# EAGLE schematic control_panel (EAGLE 6.5.0)
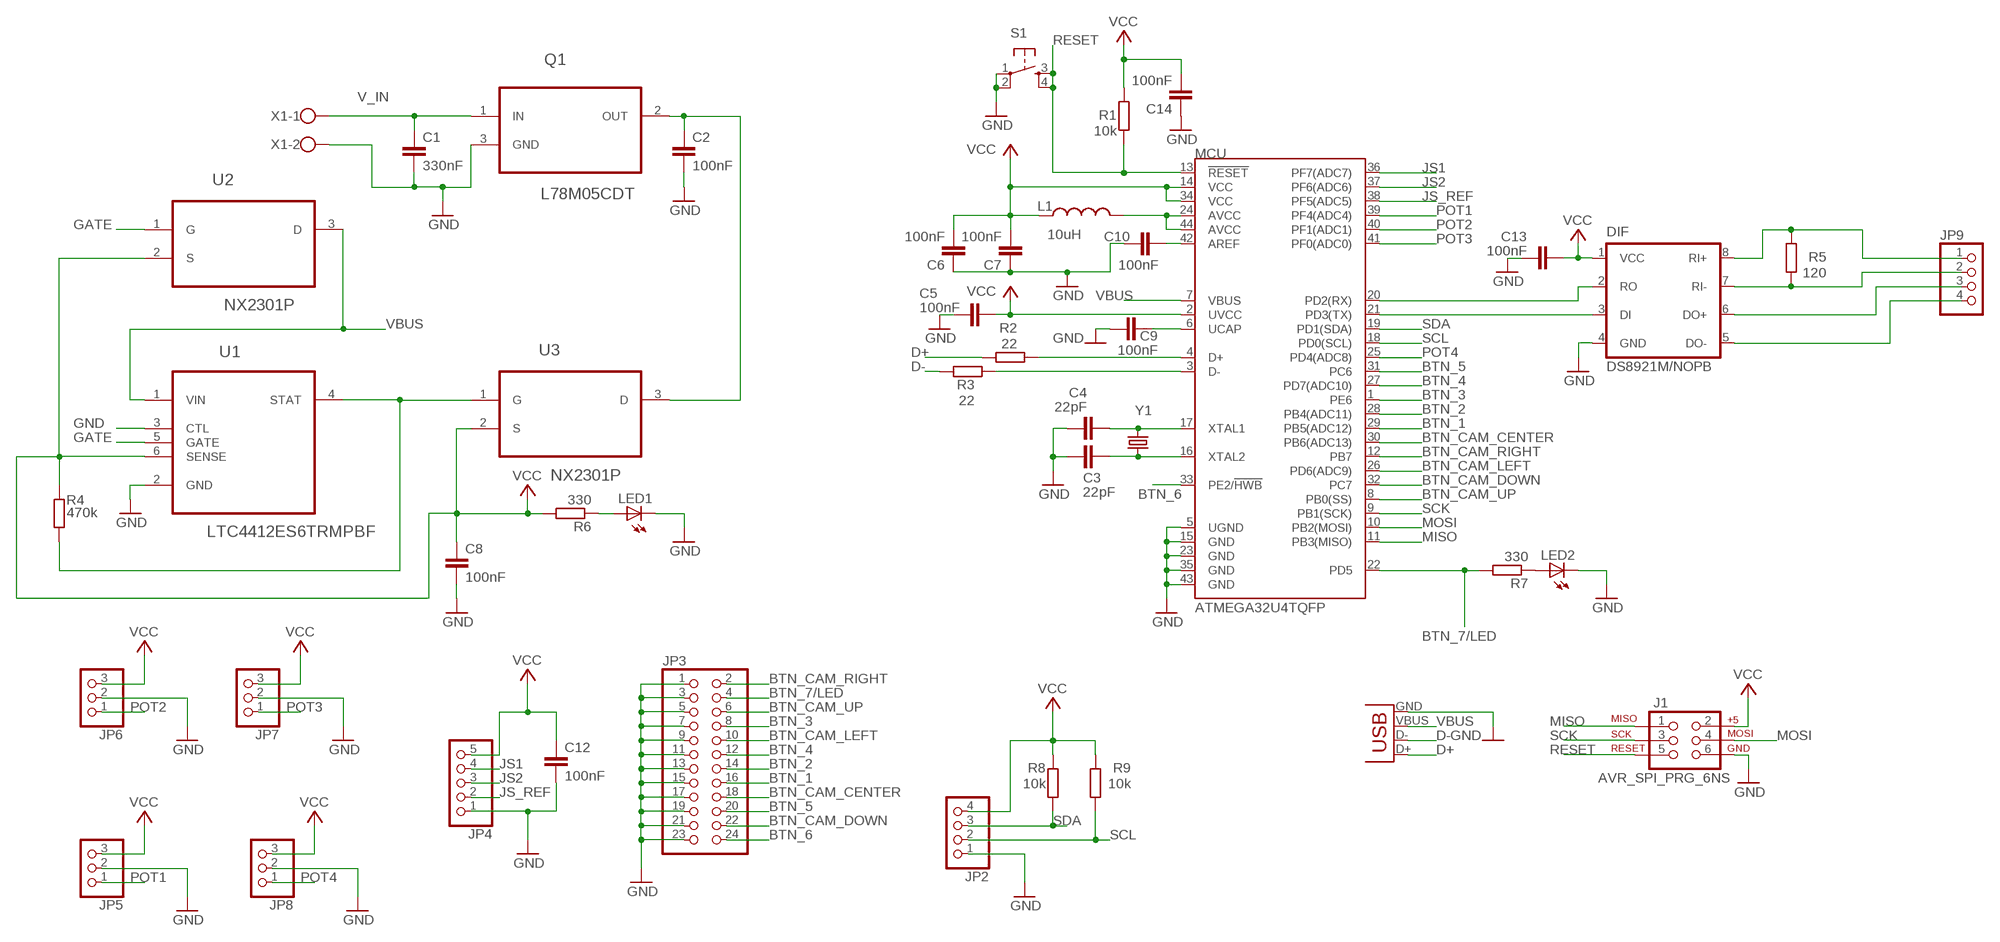
[diagram p0: schematic, sheet 1]

## Parts
C1  330nF  C-EUC0805  [C0805]
C2  100nF  C-EUC0805  [C0805]
C3  22pF  C-EUC0805  [C0805]
C4  22pF  C-EUC0805  [C0805]
C5  100nF  C-EUC0805  [C0805]
C6  100nF  C-EUC0805  [C0805]
C7  100nF  C-EUC0805  [C0805]
C8  100nF  C-EUC0805  [C0805]
C9  100nF  C-EUC0805  [C0805]
C10  100nF  C-EUC0805  [C0805]
C12  100nF  C-EUC0805  [C0805]
C13  100nF  C-EUC0805  [C0805]
C14  100nF  C-EUC0805  [C0805]
DIF  DS8921M/NOPB  [SOIC8]
J1  AVR_SPI_PRG_6NS  [2X3-NS]
JP1  USB-B  USBPTH  [USB-B-PTH]
JP2  PINHD-1X4  [1X04]
JP3  PINHD-2X12  [2X12]
JP4  PINHD-1X5  [1X05]
JP5  PINHD-1X3  [1X03]
JP6  PINHD-1X3  [1X03]
JP7  PINHD-1X3  [1X03]
JP8  PINHD-1X3  [1X03]
JP9  PINHD-1X4  [1X04]
L1  10uH  INDUCTOR0805  [0805]
LED1  LED-FKIT-1206  [FKIT-LED-1206]
LED2  LED-FKIT-1206  [FKIT-LED-1206]
MCU  ATMEGA32U4TQFP  [SPARKFUN-DIGITALIC_TQFP44]
Q1  L78M05CDT  [TO225P972X240-3N]
R1  10k  R-EU_R0805  [R0805]
R2  22  R-EU_R0805  [R0805]
R3  22  R-EU_R0805  [R0805]
R4  470k  R-EU_R0805  [R0805]
R5  120  R-EU_R0805  [R0805]
R6  330  R-EU_R0805  [R0805]
R7  330  R-EU_R0805  [R0805]
R8  10k  R-EU_R0805  [R0805]
R9  10k  R-EU_R0805  [R0805]
S1  TAC_SWITCHSMD  [TACTILE_SWITCH_SMD]
U1  LTC4412ES6TRMPBF  [SOT95P280X100-6N]
U2  NX2301P  [SOT95P230X110-3N]
U3  NX2301P  [SOT95P230X110-3N]
X1  W237-102  [W237-102]
Y1  CRYSTALSMD  [HC49UP]

## Nets
BTN_1: JP3.16 MCU.29(PB5(ADC12))
BTN_2: JP3.14 MCU.28(PB4(ADC11))
BTN_3: JP3.8 MCU.1(PE6)
BTN_4: JP3.12 MCU.27(PD7(ADC10))
BTN_5: JP3.20 MCU.31(PC6)
BTN_6: JP3.24 MCU.33(PE2/!HWB)
BTN_7/LED: JP3.4 MCU.22(PD5) R7.2
BTN_CAM_CENTER: JP3.18 MCU.30(PB6(ADC13))
BTN_CAM_DOWN: JP3.22 MCU.32(PC7)
BTN_CAM_LEFT: JP3.10 MCU.26(PD6(ADC9))
BTN_CAM_RIGHT: JP3.2 MCU.12(PB7)
BTN_CAM_UP: JP3.6 MCU.8(PB0(SS))
D+: JP1.D+ R2.2
D-: JP1.D- R3.2
DO+: DIF.6(DO+) JP9.3
DO-: DIF.5(DO-) JP9.4
GATE: U1.5(GATE) U2.1(G)
GND: C1.2 C2.2 C3.1 C4.1 C5.2 C6.1 C7.1 C8.2 C9.1 C10.2 C12.2 C13.1 C14.1 DIF.4(GND) J1.6 JP1.GND JP2.1 JP3.1 JP3.3 JP3.5 JP3.7 JP3.9 JP3.11 JP3.13 JP3.15 JP3.17 JP3.19 JP3.21 JP3.23 JP4.1 JP5.2 JP6.2 JP7.2 JP8.2 LED1.C LED2.C MCU.5(UGND) MCU.15(GND) MCU.23(GND) MCU.35(GND) MCU.43(GND) Q1.3(GND) S1.1 S1.2 U1.2(GND) U1.3(CTL) X1.2
JS1: JP4.4 MCU.36(PF7(ADC7))
JS2: JP4.3 MCU.37(PF6(ADC6))
JS_REF: JP4.2 MCU.38(PF5(ADC5))
MISO: J1.1 MCU.11(PB3(MISO))
MOSI: J1.4 MCU.10(PB2(MOSI))
N$2: C3.2 MCU.16(XTAL2) Y1.1
N$3: C4.2 MCU.17(XTAL1) Y1.2
N$4: R4.2 U1.4(STAT) U3.1(G)
N$5: DIF.2(RO) MCU.20(PD2(RX))
N$6: C9.2 MCU.6(UCAP)
N$7: MCU.4(D+) R2.1
N$8: MCU.3(D-) R3.1
N$9: LED1.A R6.1
N$10: LED2.A R7.1
N$12: DIF.3(DI) MCU.21(PD3(TX))
N$15: L1.2 MCU.24(AVCC) MCU.44(AVCC)
N$17: C10.1 MCU.42(AREF)
POT1: JP5.1 MCU.39(PF4(ADC4))
POT2: JP6.1 MCU.40(PF1(ADC1))
POT3: JP7.1 MCU.41(PF0(ADC0))
POT4: JP8.1 MCU.25(PD4(ADC8))
RESET: J1.5 MCU.13(!RESET) R1.1 S1.3 S1.4
RI+: DIF.8(RI+) JP9.1 R5.2
RI-: DIF.7(RI-) JP9.2 R5.1
SCK: J1.3 MCU.9(PB1(SCK))
SCL: JP2.2 MCU.18(PD0(SCL)) R9.1
SDA: JP2.3 MCU.19(PD1(SDA)) R8.1
V_EXT: C2.1 Q1.2(OUT) U3.3(D)
V_IN: C1.1 Q1.1(IN) X1.1
VBUS: JP1.VBUS MCU.7(VBUS) U1.1(VIN) U2.3(D)
VCC: C5.1 C6.2 C7.2 C8.1 C12.1 C13.2 C14.2 DIF.1(VCC) J1.2 JP2.4 JP4.5 JP5.3 JP6.3 JP7.3 JP8.3 L1.1 MCU.2(UVCC) MCU.14(VCC) MCU.34(VCC) R1.2 R4.1 R6.2 R8.2 R9.2 U1.6(SENSE) U2.2(S) U3.2(S)

## Library data of the parts
C1-C10 C12-C14 = resistor:C-EU: CAPACITOR, European symbol
DIF = rvp:DS8921M/NOPB
J1 = SparkFun-Connectors:AVR_SPI_PRG_6: AVR ISP 6 Pin This is the reduced ISP connector for AVR programming. Common on Arduino. This footprint will take up less PCB space and can be used with a 10-pin to 6-pin adapter such as SKU: BOB-08508
JP1 = SparkFun-Connectors:USB: USB Connectors USB-B-PTH is fully proven SKU : PRT-00139/CONN-08278 USB-miniB is fully proven SKU : PRT-00587 USB-A-PCB is untested. USB-A-H is throughly reviewed, but untested. Spark Fun Electronics SKU : PRT-00437 USB-B-SMT is throughly reviewed, but untested. Needs silkscreen touching up. USB-A-S has not been used/tested USB-MB-H has not been used/tested USB-MICROB has been used. CONN-09505; PROD_ID: CONN-08278
JP2 JP9 = pinhead:PINHD-1X4: PIN HEADER
JP3 = pinhead:PINHD-2X12: PIN HEADER
JP4 = pinhead:PINHD-1X5: PIN HEADER
JP5-JP8 = pinhead:PINHD-1X3: PIN HEADER
L1 = SparkFun-Passives:INDUCTOR: Inductors Basic Inductor/Choke - 0603 and 1206. Footprints are not proven and vary greatly between part numbers. SRN6045- 33uH, 20% 1.4A SDR0403-560KL - 56uH, 10%, 500mA RMS/740mA peak
LED1 LED2 = SparkFun-LED:LED: LEDs Standard schematic elements and footprints for 5mm, 3mm, 1206, and 0603 sized LEDs. 5mm - Spark Fun Electronics SKU : COM-00529 (and others)
MCU = SparkFun-DigitalIC:ATMEGA32U4: Atmel 44-pin 8-bit Microcontroller with 32KBytes of ISP Flash and USB Controller ----- Please use the QFN-44-NOPAD_1:1 package for the footprint of all boards using a 32U4. Route traces directly away from the pads as much as possible.
Q1 = ST Microelctronics_By_element14_Batch_1:L78M05CDT: Positive voltage regulators; MPN: L78M05CDT; OC_FARNELL: 1087116; OC_NEWARK: 78K5325; PACKAGE: DPAK; SUPPLIER: STMICROELECTRONICS
R1-R9 = resistor:R-EU_: RESISTOR, European symbol
S1 = SparkFun-Electromechanical:TAC_SWITCH: Momentary Switch Button commonly used for reset or general input. Spark Fun Electronics SKU : COM-00097 SMT- SWCH-08247; PROD_ID: SWCH-08247
U1 = LTC_By_element14_Batch_1:LTC4412ES6TRMPBF: Low Loss PowerPath Controller; MPN: LTC4412ES6#TRMPBF; OC_FARNELL: 1663917; OC_NEWARK: 19P0727; PACKAGE: TSOT-23-6; SUPPLIER: Linear Technology
U2 U3 = NXP_By_element14_Batch_1:NX2301P: P-channel Trench MOSFET; MPN: NX2301P; OC_FARNELL: 1894738; OC_NEWARK: 55T6935; PACKAGE: SOT-3; SUPPLIER: NXP
X1 = con-wago-500:W237-102: WAGO SCREW CLAMP; MPN: 237-102; OC_FARNELL: unknown; OC_NEWARK: 70K9898
Y1 = SparkFun-FreqCtrl:CRYSTAL: Various standard crystals. Proven footprints. Spark Fun Electronics SKU : COM-00534